# EAGLE design usb_sniffer_bridge (EAGLE 9.2.2)
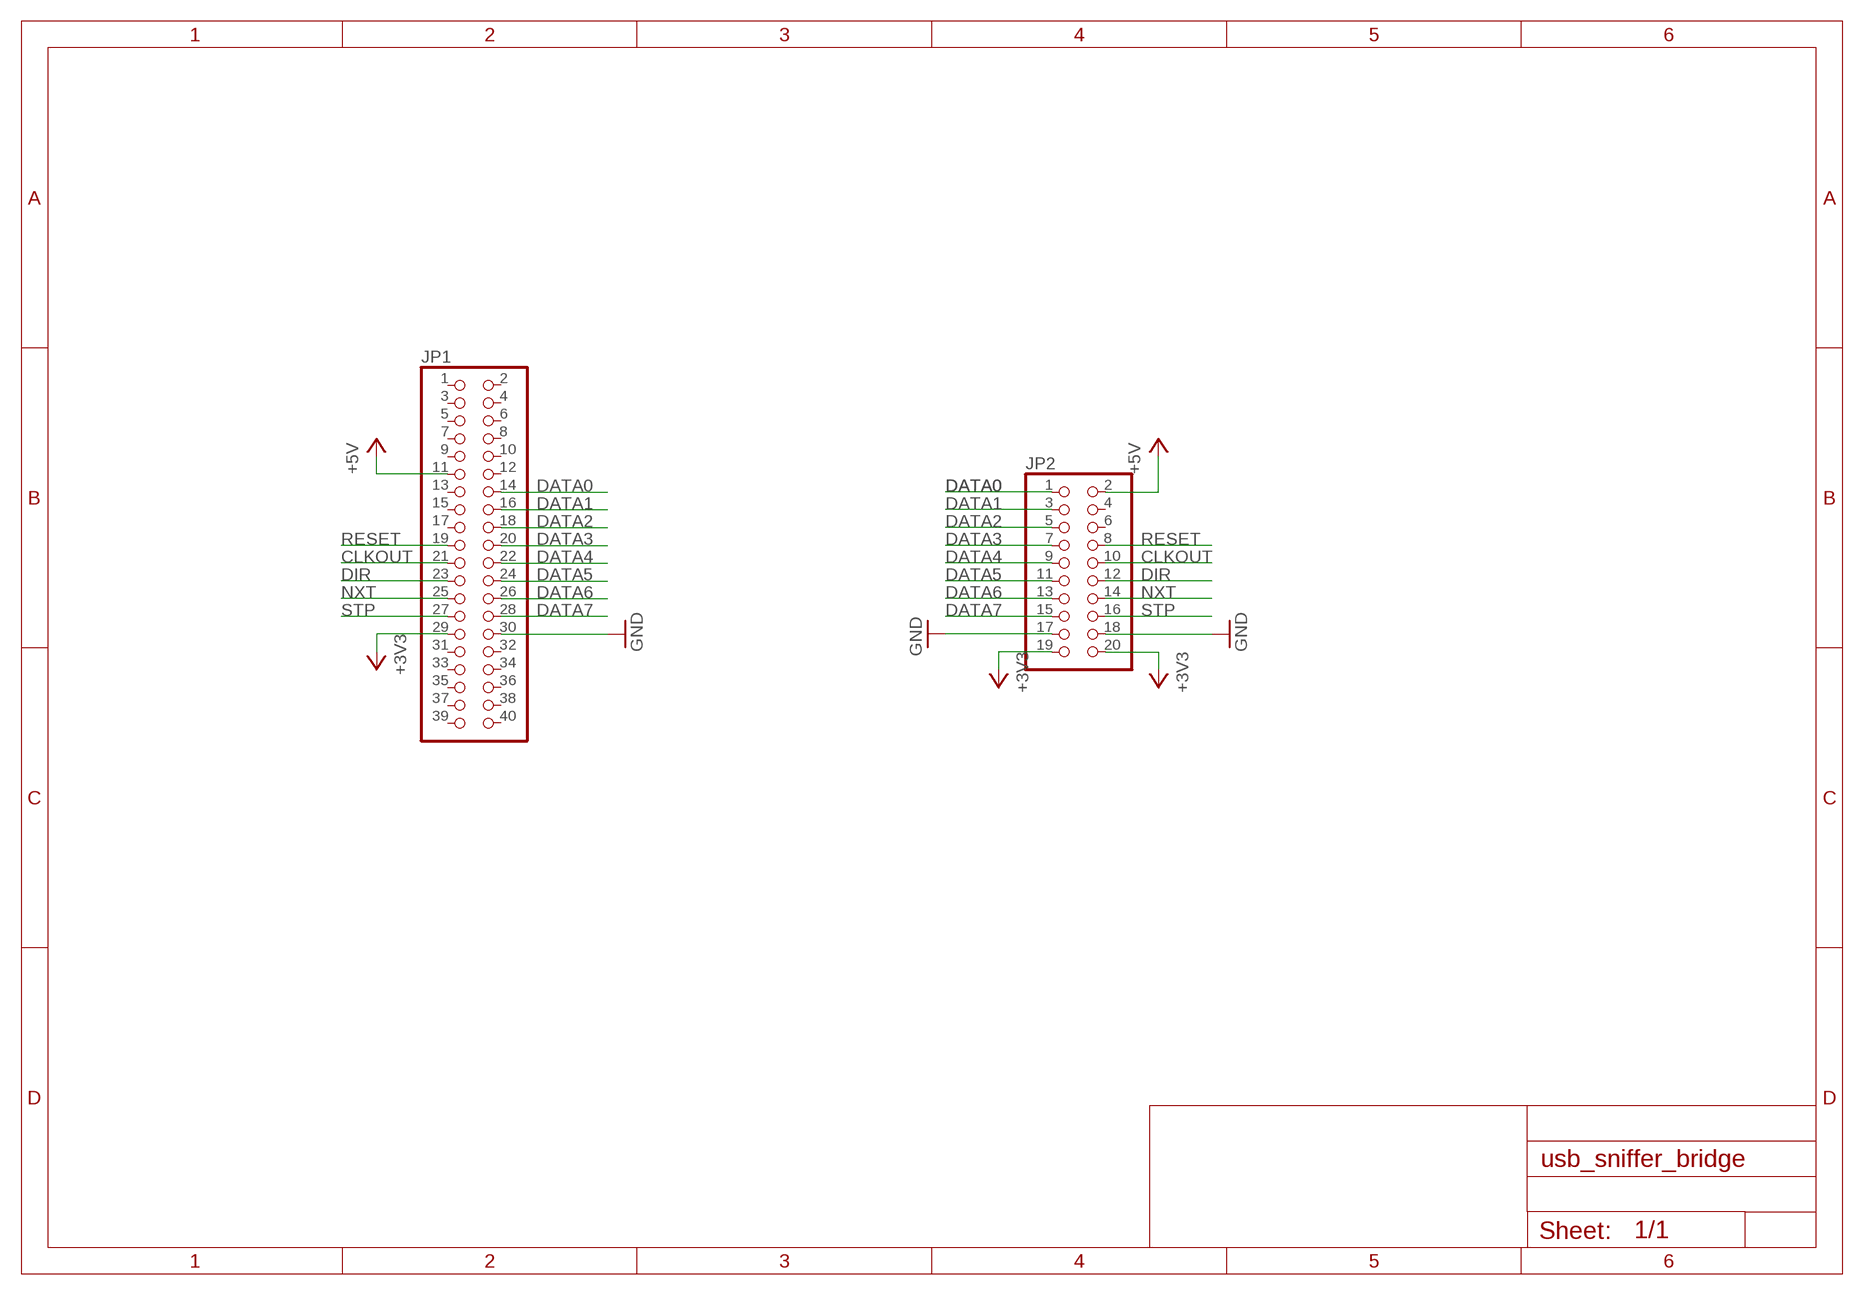
[diagram p0: schematic, sheet 1]

## Parts
JP1  PINHD-2X20  [2X20]
JP2  PINHD-2X10  [2X10]

## Nets
+3V3: JP1.29 JP2.19 JP2.20
+5V: JP1.11 JP2.2
CLKOUT: JP1.21 JP2.10
DATA0: JP1.14 JP2.1
DATA1: JP1.16 JP2.3
DATA2: JP1.18 JP2.5
DATA3: JP1.20 JP2.7
DATA4: JP1.22 JP2.9
DATA5: JP1.24 JP2.11
DATA6: JP1.26 JP2.13
DATA7: JP1.28 JP2.15
DIR: JP1.23 JP2.12
GND: JP1.30 JP2.17 JP2.18
NXT: JP1.25 JP2.14
RESET: JP1.19 JP2.8
STP: JP1.27 JP2.16
Unconnected: JP1.1 JP1.2 JP1.3 JP1.4 JP1.5 JP1.6 JP1.7 JP1.8 JP1.9 JP1.10 JP1.12 JP1.13 JP1.15 JP1.17 JP1.31 JP1.32 JP1.33 JP1.34 JP1.35 JP1.36 JP1.37 JP1.38 JP1.39 JP1.40 JP2.4 JP2.6

## Library data of the parts
JP1 = pinhead:PINHD-2X20: PIN HEADER
JP2 = pinhead:PINHD-2X10: PIN HEADER

## Board
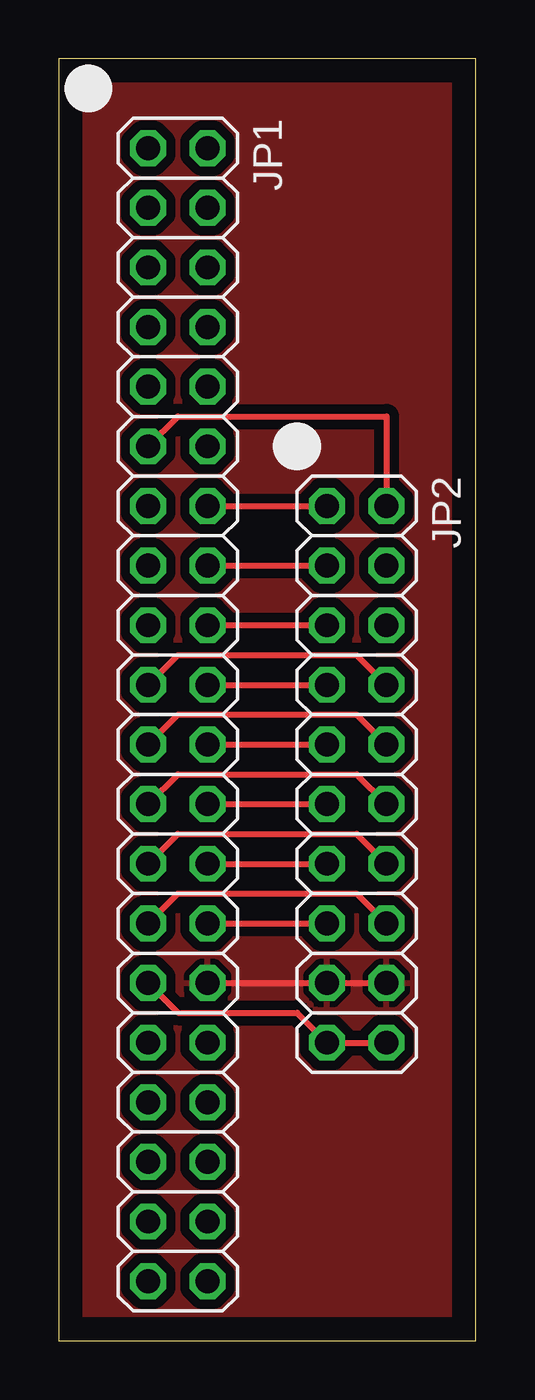
[diagram p1: board, top side]

Size 17.78 x 54.61 mm. Coordinates in mm from the lower left corner, seen from the top.
Outline: 0,0 17.78,0 17.78,54.61 0,54.61 0,0
Copper layers (1*16): Top 0.035mm / dielectric 1.5mm / Bottom 0.035mm
Design rules "default": minimum track width 6mil, minimum drill 0.35mm, track to track 6mil, track to pad 6mil, pad to pad 6mil, via to via 6mil, smd to smd 6mil, copper to edge 40mil, drill to drill 6mil, minimum pad ring 10mil, minimum via ring 8mil, stop-mask expansion 4mil, vias tented up to drill 0mil, thermal gap 10mil

### Footprints (pad centres in the part's own frame; a part is rotated, then mirrored left to right if it is on the bottom)
2X20 = drill 1.016 octagon: 1 -24.13,-1.27; 2 -24.13,1.27; 3 -21.59,-1.27; 4 -21.59,1.27; 5 -19.05,-1.27; 6 -19.05,1.27; 7 -16.51,-1.27; 8 -16.51,1.27; 9 -13.97,-1.27; 10 -13.97,1.27; 11 -11.43,-1.27; 12 -11.43,1.27; 13 -8.89,-1.27; 14 -8.89,1.27; 15 -6.35,-1.27; 16 -6.35,1.27; 17 -3.81,-1.27; 18 -3.81,1.27; 19 -1.27,-1.27; 20 -1.27,1.27; 21 1.27,-1.27; 22 1.27,1.27; 23 3.81,-1.27; 24 3.81,1.27; 25 6.35,-1.27; 26 6.35,1.27; 27 8.89,-1.27; 28 8.89,1.27; 29 11.43,-1.27; 30 11.43,1.27; 31 13.97,-1.27; 32 13.97,1.27; 33 16.51,-1.27; 34 16.51,1.27; 35 19.05,-1.27; 36 19.05,1.27; 37 21.59,-1.27; 38 21.59,1.27; 39 24.13,-1.27; 40 24.13,1.27
2X10 = drill 1.016 octagon: 1 -11.43,-1.27; 2 -11.43,1.27; 3 -8.89,-1.27; 4 -8.89,1.27; 5 -6.35,-1.27; 6 -6.35,1.27; 7 -3.81,-1.27; 8 -3.81,1.27; 9 -1.27,-1.27; 10 -1.27,1.27; 11 1.27,-1.27; 12 1.27,1.27; 13 3.81,-1.27; 14 3.81,1.27; 15 6.35,-1.27; 16 6.35,1.27; 17 8.89,-1.27; 18 8.89,1.27; 19 11.43,-1.27; 20 11.43,1.27

### Placement (x,y rotation side)
JP1  5.08,26.67 270 top
JP2  12.7,24.13 270 top

### Tracks (layer width: path | path; a pad name or v marks a point on that pad's centre or on a via)
+3V3
  Top 0.254: JP1.29 5.08,13.97 10.16,13.97 JP2.19 JP2.20
+5V
  Top 0.254: JP1.11 5.08,39.37 13.97,39.37 JP2.2
CLKOUT
  Top 0.254: JP1.21 5.08,26.67 12.7,26.67 JP2.10
DATA0
  Top 0.254: JP1.14 JP2.1
DATA1
  Top 0.254: JP1.16 JP2.3
DATA2
  Top 0.254: JP1.18 JP2.5
DATA3
  Top 0.254: JP1.20 JP2.7
DATA4
  Top 0.254: JP1.22 JP2.9
DATA5
  Top 0.254: JP1.24 JP2.11
DATA6
  Top 0.254: JP1.26 JP2.13
DATA7
  Top 0.254: JP1.28 JP2.15
DIR
  Top 0.254: JP1.23 5.08,24.13 12.7,24.13 JP2.12
GND
  Top 0.254: JP1.30 JP2.17 JP2.18
  pour Top (isolate 0.406): 0,0 0,54.61 17.78,54.61 17.78,0
NXT
  Top 0.254: JP1.25 5.08,21.59 12.7,21.59 JP2.14
RESET
  Top 0.254: JP1.19 5.08,29.21 12.7,29.21 JP2.8
STP
  Top 0.254: JP1.27 5.08,19.05 12.7,19.05 JP2.16